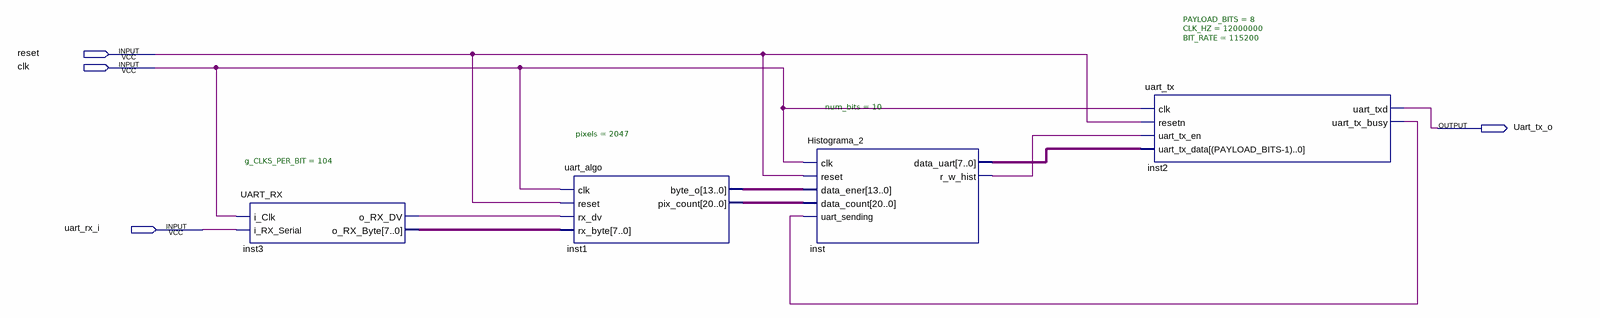
[diagram p0: schematic sheet]
// Quartus schematic Block2.bdf as structural Verilog: 4 symbols, 4 pins
module Block2 (
  input  reset,
  input  clk,
  input  uart_rx_i,
  output Uart_tx_o
);

  wire inst2_uart_tx_busy, inst3_o_rx_dv, inst_r_w_hist;
  wire [7:0] inst3_o_rx_byte, inst_data_uart;
  wire [13:0] inst1_byte_o;
  wire [20:0] inst1_pix_count;

  UART_RX #(.g_CLKS_PER_BIT(104)) inst3 (
    .i_Clk(clk), .i_RX_Serial(uart_rx_i), .o_RX_DV(inst3_o_rx_dv), .o_RX_Byte(inst3_o_rx_byte));
  uart_algo #(.pixels(2047)) inst1 (
    .clk(clk), .reset(reset), .rx_dv(inst3_o_rx_dv), .rx_byte(inst3_o_rx_byte), .byte_o(inst1_byte_o),
    .pix_count(inst1_pix_count));
  Histograma_2 #(.num_bits(10)) inst (
    .clk(clk), .reset(reset), .data_ener(inst1_byte_o), .data_count(inst1_pix_count),
    .uart_sending(inst2_uart_tx_busy), .data_uart(inst_data_uart), .r_w_hist(inst_r_w_hist));
  uart_tx #(.PAYLOAD_BITS(8), .CLK_HZ(12000000), .BIT_RATE(115200)) inst2 (
    .clk(clk), .resetn(reset), .uart_tx_en(inst_r_w_hist), .uart_tx_data(inst_data_uart),
    .uart_txd(Uart_tx_o), .uart_tx_busy(inst2_uart_tx_busy));
endmodule
